# EAGLE design kossr (EAGLE 6.6.0)
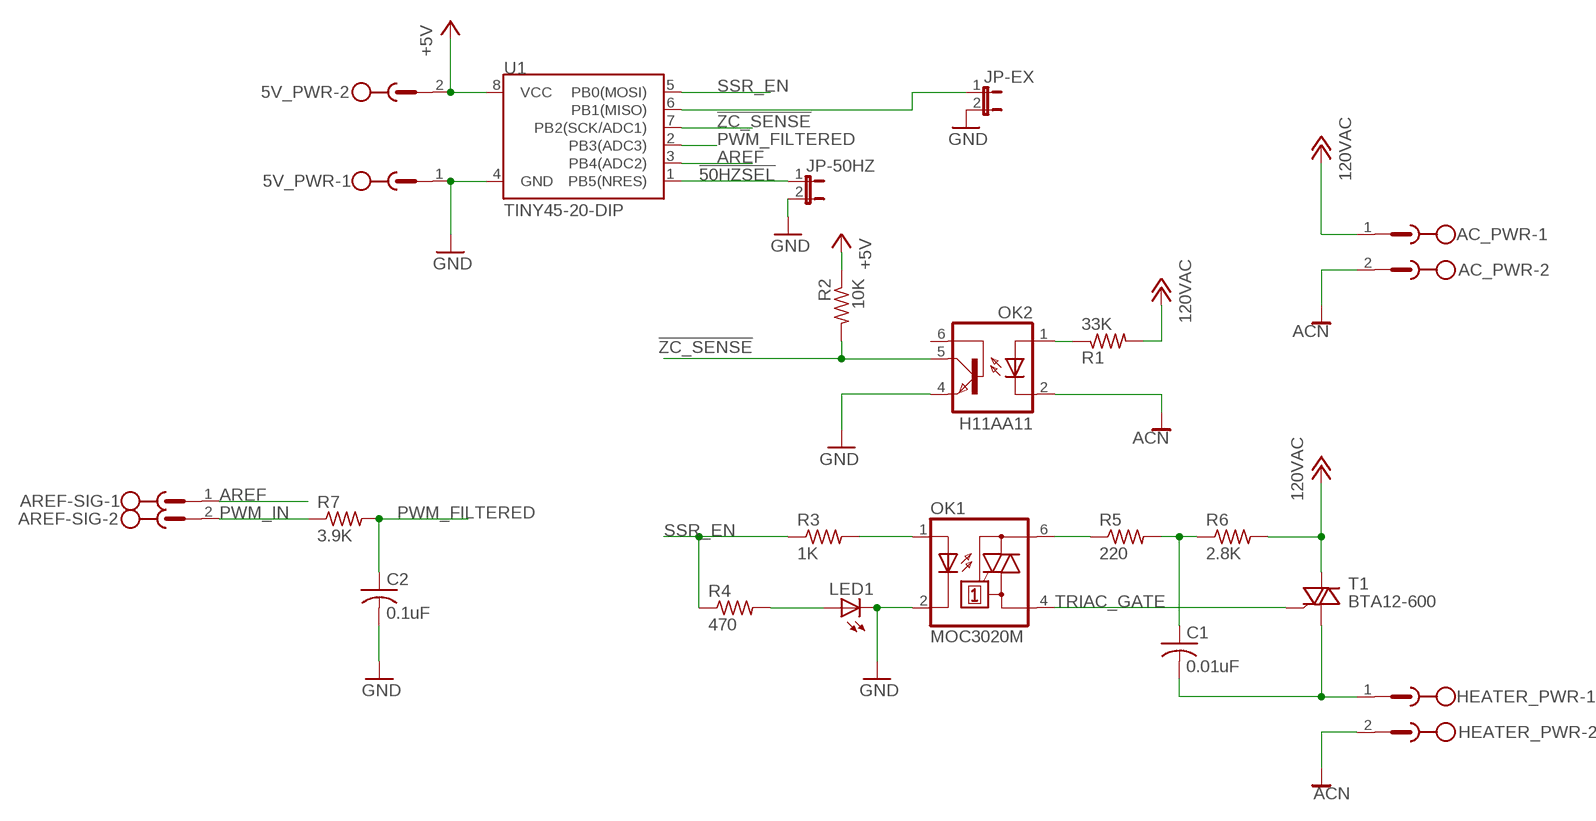
[diagram p0: schematic, sheet 1]

## Parts
5V_PWR  MSTBV2  [MSTBV2]
AC_PWR  MSTBV2  [MSTBV2]
AREF-SIG  MSTBV2  [MSTBV2]
C1  0.01uF  C-US050-024X044  [C050-024X044]
C2  0.1uF  C-US025-024X044  [C025-024X044]
HEATER_PWR  MSTBV2  [MSTBV2]
JP-50HZ  JUMPER-2SMD-NO  [SJ_2S-NO]
JP-EX  JUMPER-2SMD-NO  [SJ_2S-NO]
LED1  LED3MM  [LED3MM]
OK1  MOC3020M  [DIL06]
OK2  H11AA11  [DIL06]
R1  33K  R-US_0207/7  [0207/7]
R2  10K  R-US_0207/7  [0207/7]
R3  1K  R-US_0207/7  [0207/7]
R4  470  R-US_0207/7  [0207/7]
R5  220  R-US_0207/7  [0207/7]
R6  2.8K  R-US_0207/7  [0207/7]
R7  3.9K  R-US_0207/7  [0207/7]
T1  BTA12-600  [TO220AB]
U1  TINY45-20-DIP  ATTINY45TINY45-20-DIP  [DIP08]

## Nets
!50HZSEL: JP-50HZ.1 U1.1(PB5(NRES))
!EX: JP-EX.1 U1.6(PB1(MISO))
!ZC_SENSE: OK2.5(COL) R2.2 U1.7(PB2(SCK/ADC1))
+5V: 5V_PWR.2 R2.1 U1.8(VCC)
ACHOT [thick]: AC_PWR.1 R1.2 R6.2 T1.2(A2) ; supply symbol labelled 120VAC
ACN [thick]: AC_PWR.2 HEATER_PWR.2 OK2.2(C)
AREF: AREF-SIG.1 U1.3(PB4(ADC2))
GND: 5V_PWR.1 C2.2 JP-50HZ.2 JP-EX.2 LED1.K(C) OK1.2(C) OK2.4(EMI) U1.4(GND)
HEATERHOT [thick]: C1.2 HEATER_PWR.1 T1.1(A1)
N$1 [med]: OK2.1(A) R1.1
N$2: LED1.A R4.2
N$3: OK1.1(A) R3.2
N$6 [med]: C1.1 R5.2 R6.1
N$7 [med]: OK1.6(A2) R5.1
PWM_FILTERED: C2.1 R7.2 U1.2(PB3(ADC3))
PWM_IN: AREF-SIG.2 R7.1
SSR_EN: R3.1 R4.1 U1.5(PB0(MOSI))
TRIAC_GATE [med]: OK1.4(A1) T1.3(G)
Unconnected: OK2.6(BAS)

## Library data of the parts
5V_PWR AC_PWR AREF-SIG HEATER_PWR = con-phoenix-500:MSTBV2: PHOENIX; OC_FARNELL: unknown; OC_NEWARK: unknown
C1 C2 = adafruit:C-US: CAPACITOR, American symbol
JP-50HZ JP-EX = SparkFun-Retired:JUMPER-2: Jumper Basic 0.1" spaced jumper. Use with breakaway headers.
LED1 = led:LED: LED OSRAM: - CHIPLED LG R971, LG N971, LY N971, LG Q971, LY Q971, LO R971, LY R971 LH N974, LH R974 LS Q976, LO Q976, LY Q976 LO Q996 - Hyper CHIPLED LW Q18S LB Q993, LB Q99A, LB R99A - SideLED LS A670, LO A670, LY A670, LG A670, LP A670 LB A673, LV A673, LT A673, LW A673 LH A674 LY A675 LS A676, LA A676, LO A676, LY A676, LW A676 LS A679, LY A679, LG A679 - Hyper Micro SIDELED® LS Y876, LA Y876, LO Y876, LY Y876 LT Y87S - SmartLED LW L88C, LW L88S LB L89C, LB L89S, LG L890 LS L89K, LO L89K, LY L89K LS L896, LA L896, LO L896, LY L896 - TOPLED LS T670, LO T670, LY T670, LG T670, LP T670 LSG T670, LSP T670, LSY T670, LOP T670, LYG T670 LG T671, LOG T671, LSG T671 LB T673, LV T673, LT T673, LW T673 LH T674 LS T676, LA T676, LO T676, LY T676, LB T676, LH T676, LSB T676, LW T676 LB T67C, LV T67C, LT T67C, LS T67K, LO T67K, LY T67K, LW E67C LS E67B, LA E67B, LO E67B, LY E67B, LB E67C, LV E67C, LT E67C LW T67C LS T679, LY T679, LG T679 LS T770, LO T770, LY T770, LG T770, LP T770 LB T773, LV T773, LT T773, LW T773 LH T774 LS E675, LA E675, LY E675, LS T675 LS T776, LA T776, LO T776, LY T776, LB T776 LHGB T686 LT T68C, LB T68C - Hyper Mini TOPLED® LB M676 - Mini TOPLED Santana® LG M470 LS M47K, LO M47K, LY M47K Source: http://www.osram.convergy.de LUXEON: - LUMILED® LXK2-PW12-R00, LXK2-PW12-S00, LXK2-PW14-U00, LXK2-PW14-V00 LXK2-PM12-R00, LXK2-PM12-S00, LXK2-PM14-U00 LXK2-PE12-Q00, LXK2-PE12-R00, LXK2-PE12-S00, LXK2-PE14-T00, LXK2-PE14-U00 LXK2-PB12-K00, LXK2-PB12-L00, LXK2-PB12-M00, LXK2-PB14-N00, LXK2-PB14-P00, LXK2-PB14-Q00 LXK2-PR12-L00, LXK2-PR12-M00, LXK2-PR14-Q00, LXK2-PR14-R00 LXK2-PD12-Q00, LXK2-PD12-R00, LXK2-PD12-S00 LXK2-PH12-R00, LXK2-PH12-S00 LXK2-PL12-P00, LXK2-PL12-Q00, LXK2-PL12-R00 Source: www.luxeon.com KINGBRIGHT: KA-3528ASYC Source: www.kingbright.com
OK1 = optocoupler:MOC30*M: RANDOM-PHASE OPTOISOLATORS TRIAC DRIVER OUTPUT Source: http://www.fairchildsemi.com MOC3020-M.pdf; MF: FAIRCHILD SEMICONDUCTOR; MPN: MOC3020-M; OC_FARNELL: 1505425; OC_NEWARK: 72K8895
OK2 = twomey:H11AA1: Optocoupler AC Input 1 Channel Trans W/Base DC Output 6-Pin DIP Source: http://www.jameco.com/webapp/wcs/stores/servlet/Product_10001_10001_18825_-1; MPN: H11A1-M; OC_FARNELL: 1021358; OC_NEWARK: 97K1793
R1-R7 = rcl:R-US_: RESISTOR, American symbol
T1 = twomey:BTA12-600: Thyristor TRIAC 600 Volt 126A 3-Pin (3+Tab) TO-220AB Isolated Tube Source: http://www.jameco.com/Jameco/Products/ProdDS/2034010.pdf
U1 = SparkFun-DigitalIC:ATTINY45: Atmel 8-pin 2/4/8kB flash uC; PROD_ID: IC-09439

## Net classes
1 thick: width 2.032 mm
2 med: width 1.016 mm

## Board
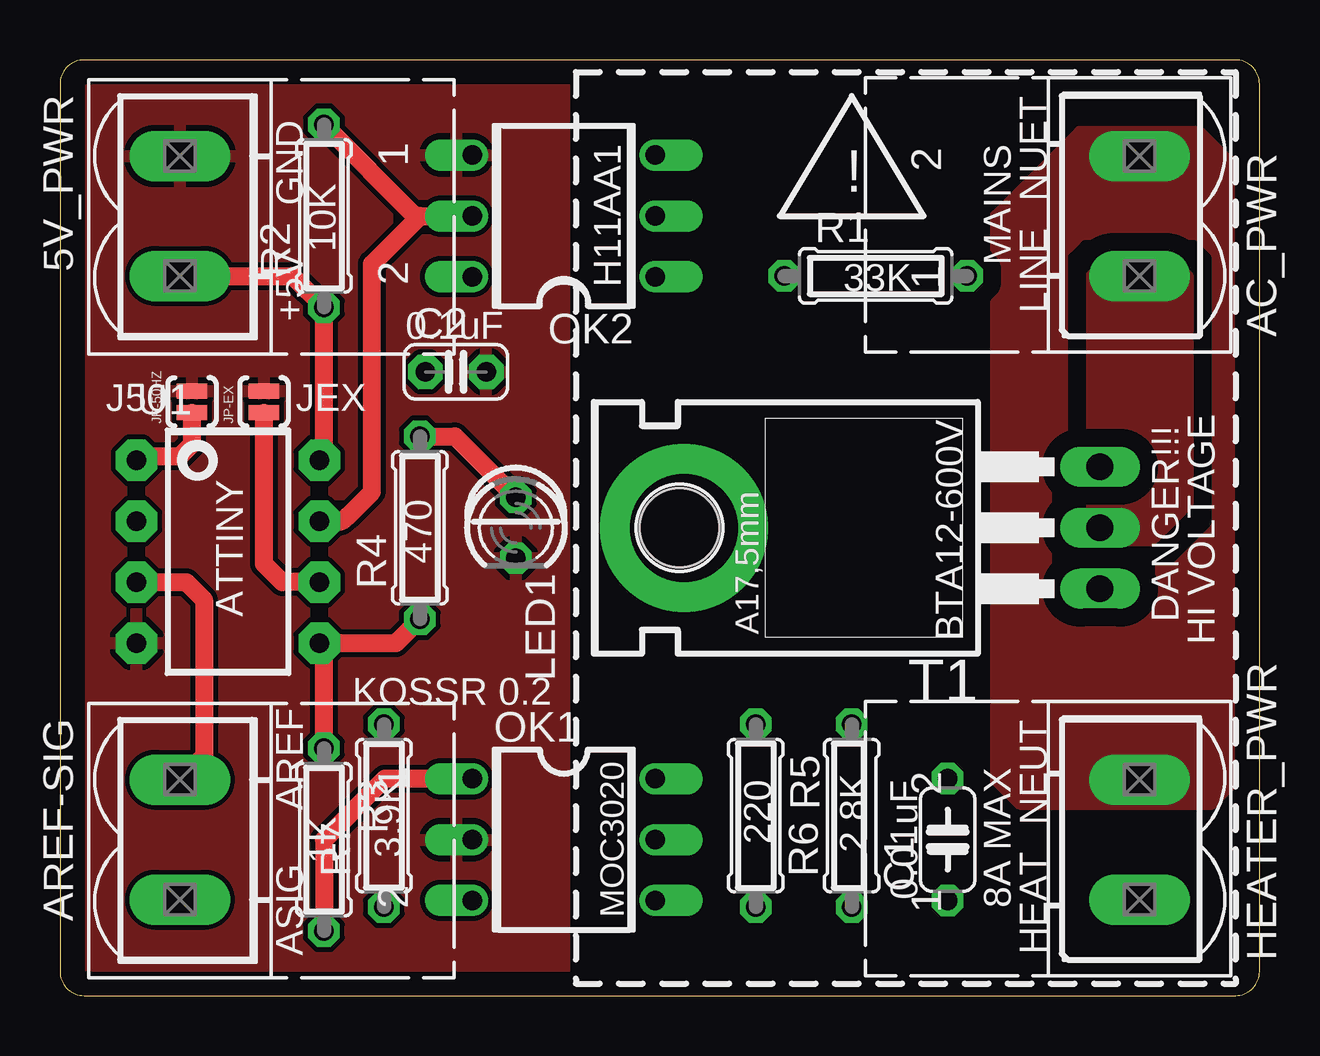
[diagram p1: board, top side]
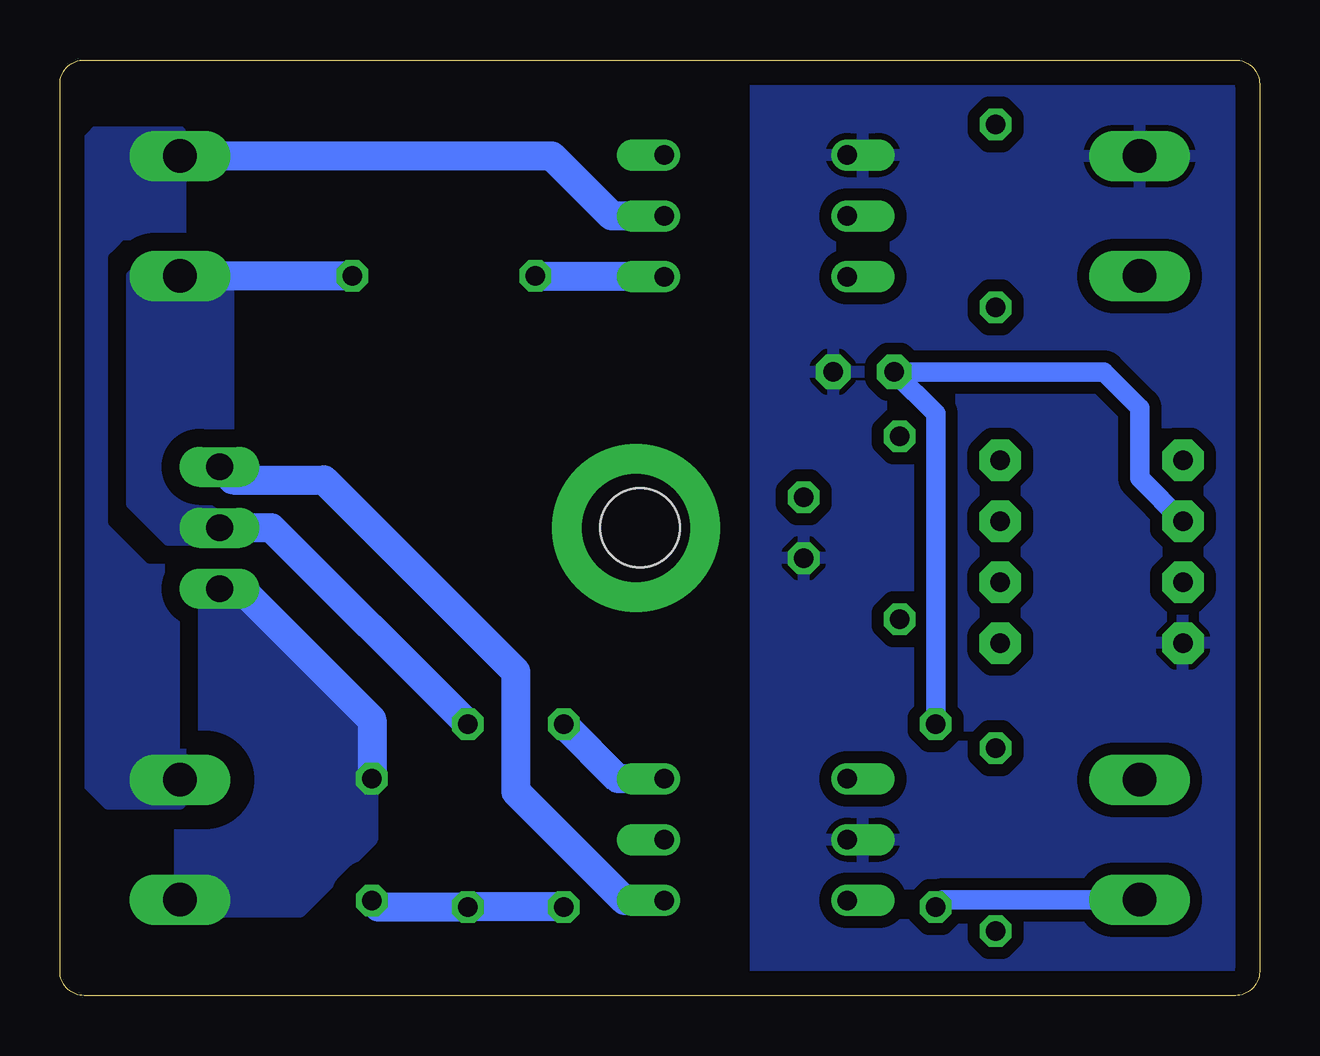
[diagram p2: board, bottom side, seen from below]

Size 50 x 39 mm. Coordinates in mm from the lower left corner, seen from the top.
Outline: 50,1 50,38 arc90 49,39 1,39 arc90 0,38 0,1 arc90 1,0 49,0 arc90 50,1
Copper layers (1*16): Top 0.035mm / dielectric 1.5mm / Bottom 0.035mm
Design rules "default": minimum track width 10mil, minimum drill 24mil, track to track 8mil, track to pad 8mil, pad to pad 8mil, via to via 8mil, smd to smd 8mil, copper to edge 40mil, drill to drill 8mil, minimum pad ring 10mil, minimum via ring 8mil, stop-mask expansion 4mil, vias tented up to drill 0mil, thermal gap 10mil

### Footprints (pad centres in the part's own frame; a part is rotated, then mirrored left to right if it is on the bottom)
MSTBV2 = drill 1.397 long: 1 -2.5,0; 2 2.5,0
C050-024X044 = drill 0.813 octagon: 1 -2.54,0; 2 2.54,0
C025-024X044 = drill 0.813 pad 1.422 octagon: 1 -1.27,0; 2 1.27,0
SJ_2S-NO = smd 0.635 x 1.27: 1 -0.45,0; 2 0.45,0
LED3MM = drill 0.813 octagon: A -1.27,0; K 1.27,0
DIL06 = drill 0.813 offset: 1 -2.54,-3.81; 2 0,-3.81; 3 2.54,-3.81; 4 2.54,3.81; 5 0,3.81; 6 -2.54,3.81
0207/7 = drill 0.813 octagon: 1 -3.81,0; 2 3.81,0
TO220AB = drill 1.118 long: 1 -2.54,-6.35; 2 0,-6.35; 3 2.54,-6.35 | hole 3.302: 0,11.176
DIP08 = drill 0.813 pad 1.727 octagon: 1 -3.81,-3.81; 2 -1.27,-3.81; 3 1.27,-3.81; 4 3.81,-3.81; 5 3.81,3.81; 6 1.27,3.81; 7 -1.27,3.81; 8 -3.81,3.81

### Placement (x,y rotation side)
5V_PWR  5,32.5 270 top
AC_PWR  45,32.5 90 top
AREF-SIG  5,6.5 270 top
C1  37,6.5 90 top
C2  16.5,26 0 top
HEATER_PWR  45,6.5 90 top
JP-50HZ  5.5,24.75 90 top
JP-EX  8.5,24.75 90 top
LED1  19,19.5 270 top
OK1  21,6.5 270 top
OK2  21,32.5 90 top
R1  34,30 0 top
R2  11,32.5 90 top
R3  11,6.5 270 top
R4  15,19.5 90 top
R5  29,7.5 270 top
R6  33,7.5 90 top
R7  13.5,7.5 90 top
T1  37,19.5 90 top
U1  7,18.5 270 top

### Tracks (layer width: path | path; a pad name or v marks a point on that pad's centre or on a via)
!50HZSEL
  Top 0.75: U1.1 3.38,22.5 5,22.5 5.5,23 JP-50HZ.1
!EX
  Top 0.75: U1.6 9.27,17.23 8.5,18 JP-EX.1
!ZC_SENSE
  Top 0.75: U1.7 11.73,19.77 12,20 13,21 13,30.5 15,32.5 | R2.2 14.81,32.5 15,32.5 | 15,32.5 OK2.5
+5V
  Top 0.75: 5V_PWR.2 9.69,30 R2.1 11,22.5 U1.8
ACHOT
  Bottom 1.2: R1.2 AC_PWR.1 | R6.2 41.19,19.5 T1.2
  pour Bottom (isolate 0.75, no thermals): 43,19 45.5,19 47,20.5 47,30 46.5,30.5 43.5,30.5 43,30
  pour Top (isolate 0.75, no thermals): 43,19 45.5,19 47,20.5 47,30 46.5,30.5 43.5,30.5 43,30
ACN
  Bottom 1.2: OK2.2 27,32.5 29.5,35 AC_PWR.2
  pour Bottom (isolate 0.75, rank 2, no thermals): 45,8 48,8 50,10 50,34.5 48.5,36 45,36
  pour Top (isolate 0.75, rank 4, no thermals): 47.5,36 42.5,36 39,32.5 39,9 40,8 48,8 49,9 49,34.5
AREF
  Top 0.75: U1.3 5.27,17.23 6,16.5 6,10 AREF-SIG.1
GND
  pour Top (rank 3): 0,39 21,39 21,0 0,0
  pour Bottom (isolate 0.5, rank 6): -0.5,39.5 -0.5,-0.5 21,-0.5 21,39.5
HEATERHOT
  Bottom 1.2: T1.1 42.46,16.96 37,11.5 C1.2
  pour Bottom (isolate 1, no thermals): 45,4 45,8.5 44,9.5 44,17.5 42.5,17.5 37,12 37,6.5 40,3.5 44.5,3.5
N$1
  Bottom 1.016: 30.15,29.96 R1.1
  Bottom 1.2: OK2.1 30.15,29.96
N$2
  Top 0.75: R4.2 16.46,23.31 LED1.A
N$3
  Top 0.75: OK1.1 13.54,9.04 11,6.5 R3.2
N$4  (via drill 4.5 pad 7)
  other vias: 26,19.5
N$6
  Bottom 1.016: C1.1 36.73,3.69
  Bottom 1.2: R5.2 R6.1 36.73,3.69
N$7
  Bottom 1.2: OK1.6 26.73,9.04 R5.1
PWM_FILTERED
  Bottom 0.813: U1.2 5,21.58 5,24.5 6.5,26 C2.1 13.5,24.27 R7.2
PWM_IN
  Bottom 0.813: AREF-SIG.2 13.19,4 R7.1
SSR_EN
  Top 0.75: R4.1 14,14.69 U1.5 11,14.5 R3.1
TRIAC_GATE
  Bottom 1.016: T1.3 42.81,21.5
  Bottom 1.2: OK1.4 26.46,3.96 31,8.5 31,13.5 39,21.5 42.81,21.5

### Text on the board
top_silk: NUET | GND | H11AA1 | MAINS | ! | LINE | +5V | 10K | 33K | 0.1uF | J50 | JEX | BTA12-600V | DANGER!!! | HI VOLTAGE | ATTINY | 470 | KOSSR 0.2 | AREF | NEUT | MOC3020 | 8A MAX | 220 | 2.8K | ASIG | 1K | 3.9K | HEAT | 0.01uF